# Altium project Sensor.PrjPcb
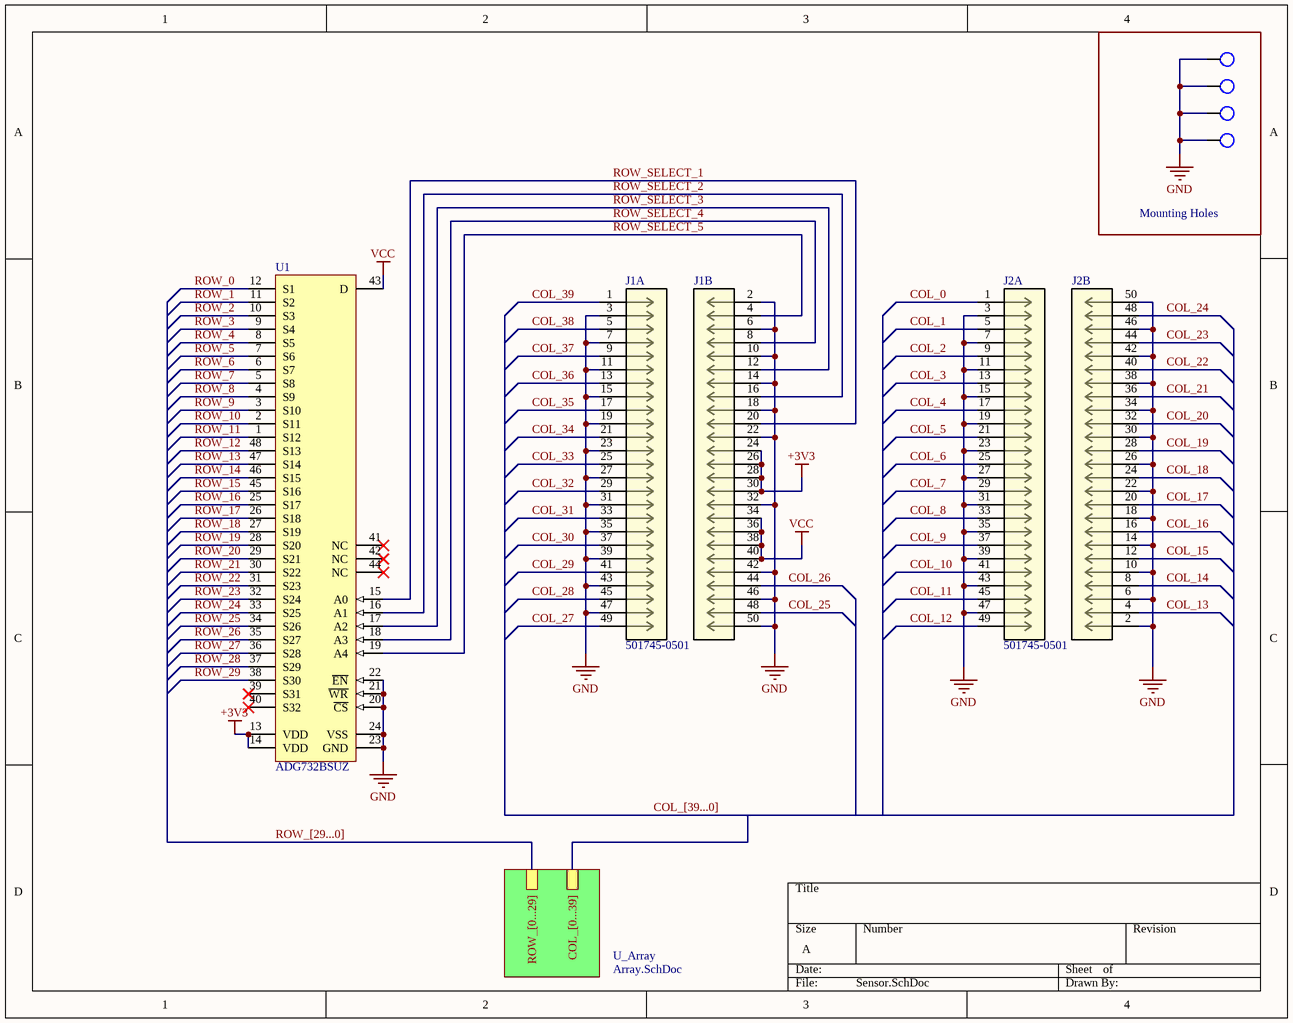
[diagram p0: Sensor.SchDoc]
1 sheet, 7 parts. Net scope: global (net labels, ports and power ports of the same name join across sheets).
Board file: Sensor.PcbDoc

## Sheet Sensor.SchDoc
size A; SheetNumber: 1; SheetTotal: 2

### Parts
J1  501745-0501  [501745-0501]  (parts A,B of 2)
J2  501745-0501  [501745-0501]  (parts A,B of 2)
MP1  M3 MOUNTING HOLE  [M3 MOUNTING HOLE]  (value not drawn)
MP2  M3 MOUNTING HOLE  [M3 MOUNTING HOLE]  (value not drawn)
MP3  M3 MOUNTING HOLE  [M3 MOUNTING HOLE]  (value not drawn)
MP4  M3 MOUNTING HOLE  [M3 MOUNTING HOLE]  (value not drawn)
U1  ADG732BSUZ  [ADI-SU-48_M]

### Blocks framed on the sheet
Mounting Holes: MP1-MP4

### Sub-sheets
U_Array = Array.SchDoc (file not in this document): COL_[0...39], ROW_[0...29]

### Nets
+3V3: J1.24 J1.26 J1.28 J1.30 U1.13(VDD) U1.14(VDD)
GND: J1.2 J1.3 J1.6 J1.7 J1.10 J1.11 J1.14 J1.15 J1.18 J1.19 J1.22 J1.23 J1.27 J1.31 J1.32 J1.35 J1.39 J1.42 J1.43 J1.46 J1.47 J1.50 J2.2 J2.3 J2.6 J2.7 J2.10 J2.11 J2.14 J2.15 J2.18 J2.19 J2.22 J2.23 J2.26 J2.27 J2.30 J2.31 J2.34 J2.35 J2.38 J2.39 J2.42 J2.43 J2.46 J2.47 J2.50 MP1.1 MP2.1 MP3.1 MP4.1 U1.20(~{CS}) U1.21(~{WR}) U1.22(~{EN}) U1.23(GND) U1.24(VSS)
VCC: J1.34 J1.36 J1.38 J1.40 U1.43(D)
COL_0: J2.1
COL_1: J2.5
COL_2: J2.9
COL_3: J2.13
COL_4: J2.17
COL_5: J2.21
COL_6: J2.25
COL_7: J2.29
COL_8: J2.33
COL_9: J2.37
COL_10: J2.41
COL_11: J2.45
COL_12: J2.49
COL_13: J2.4
COL_14: J2.8
COL_15: J2.12
COL_16: J2.16
COL_17: J2.20
COL_18: J2.24
COL_19: J2.28
COL_20: J2.32
COL_21: J2.36
COL_22: J2.40
COL_23: J2.44
COL_24: J2.48
COL_25: J1.48
COL_26: J1.44
COL_27: J1.49
COL_28: J1.45
COL_29: J1.41
COL_30: J1.37
COL_31: J1.33
COL_32: J1.29
COL_33: J1.25
COL_34: J1.21
COL_35: J1.17
COL_36: J1.13
COL_37: J1.9
COL_38: J1.5
COL_39: J1.1
ROW_0: U1.12(S1)
ROW_1: U1.11(S2)
ROW_2: U1.10(S3)
ROW_3: U1.9(S4)
ROW_4: U1.8(S5)
ROW_5: U1.7(S6)
ROW_6: U1.6(S7)
ROW_7: U1.5(S8)
ROW_8: U1.4(S9)
ROW_9: U1.3(S10)
ROW_10: U1.2(S11)
ROW_11: U1.1(S12)
ROW_12: U1.48(S13)
ROW_13: U1.47(S14)
ROW_14: U1.46(S15)
ROW_15: U1.45(S16)
ROW_16: U1.25(S17)
ROW_17: U1.26(S18)
ROW_18: U1.27(S19)
ROW_19: U1.28(S20)
ROW_20: U1.29(S21)
ROW_21: U1.30(S22)
ROW_22: U1.31(S23)
ROW_23: U1.32(S24)
ROW_24: U1.33(S25)
ROW_25: U1.34(S26)
ROW_26: U1.35(S27)
ROW_27: U1.36(S28)
ROW_28: U1.37(S29)
ROW_29: U1.38(S30)
ROW_SELECT_1: J1.20 U1.15(A0)
ROW_SELECT_2: J1.16 U1.16(A1)
ROW_SELECT_3: J1.12 U1.17(A2)
ROW_SELECT_4: J1.8 U1.18(A3)
ROW_SELECT_5: J1.4 U1.19(A4)

Not connected (* = marked no-connect by the designer): U1 39(S31)* 40(S32)* 41(NC)* 42(NC)* 44(NC)*

### Buses and harness runs
bus COL_[39...0] = sheet U_Array/COL_[0...39]
bus ROW_[29...0] = sheet U_Array/ROW_[0...29]

### Library data of the parts
J1 J2 = 501745-0501: Board Connector, 50 Contact(s), 2 Row(s), Male, Straight, 0.016 inch Pitch, Surface Mount Terminal, Locking, Black Insulator, Plug; Manufacturer: Molex; Supplier: Arrow Electronics; Supplier Part Number: 501745-0501; Manufacturer Part Number: 501745-0501; RoHS: Yes; Category: Headers and Wire Housings; Stock: 14564; Pricing: 1=1.5127, 10=1.3668, 100=1.2034, 1000=1.0168, 2500=0.8155 (USD); Contact Finish - Mating: NOT SPECIFIED; Connector Type: BOARD CONNECTOR; Reach SVHC Compliant: Yes; RoHS Compliant: Yes; ComponentLink1URL: https://datasheet.ciiva.com/401/5017450401-sd-401812.pdf?src-supplier=Digi-Key; ComponentLink1Description: https://datasheet.ciiva.com/401/5017450401-sd-401812.pdf?src-supplier=Digi-Key; ComponentLink2URL: https://datasheet.ciiva.com/5130/5017450501-pcb-headers-155391-5130000.pdf?src-supplier=Mouser; ComponentLink2Description: https://datasheet.ciiva.com/5130/5017450501-pcb-headers-155391-5130000.pdf?src-supplier=Mouser; ComponentLink3URL: https://datasheet.ciiva.com/10071/5017450501-pcb-headers-10071686.pdf?src-supplier=Avnet; ComponentLink3Description: https://datasheet.ciiva.com/10071/5017450501-pcb-headers-10071686.pdf?src-supplier=Avnet; System: Connector
U1 = CMP-0798-00241-1: 1.8 to 5.5 V / +/-2.5 V, 4 Ohm, 32-Channel Analog Multiplexer, -40 to 85 degC, 48-pin QFP (SU-48), Tray; Manufacturer: Analog Devices; Max Analog Signal Range: Vss to Vdd; Ron (ohms): 4; Bandwidth (Hz): 18M; t transition (s): 23n; Supply V Guar Performance: Dual_(+/-2.5V), Single_(+3V), Single_(+5V); ComponentLink3URL: http://www.analog.com/static/imported-files/packages/470644706845302410119987SU48_7x7.pdf; PartNumber: ADG732BSUZ; ComponentLink2Description: Datasheet; ComponentLink1Description: Manufacturer URL; Code_JEDEC: MS-026ABC; ComponentLink2URL: http://www.analog.com/static/imported-files/data_sheets/ADG726_732.pdf; PackageDescription: 48-Pin Thin Plastic Quad Flat Package, Body 7 x 7 mm, Pitch 0.5 mm; ComponentLink3Description: Package Specification; ComponentLink1URL: http://www.analog.com/en/index.html; Packing: Tray; DatasheetVersion: Rev. 0; PackageReference: SU-48; Mounting Technology: Surface Mount